# Altium schematic sheet Flash.SchDoc
size A4; SheetNumber: 3; SheetTotal: 4
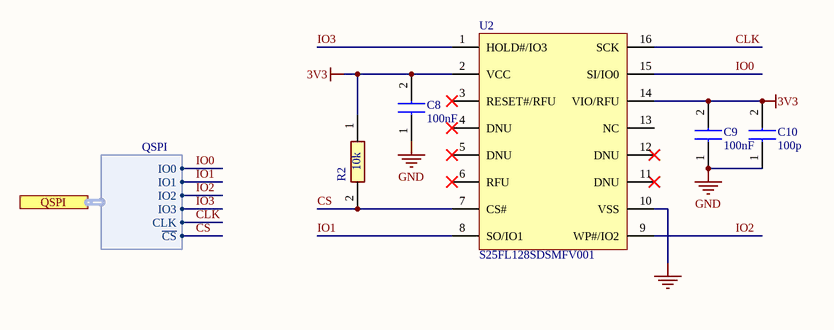
[diagram p0: Flash.SchDoc]

## Parts
C8  100nF  [CAPC1005X70N]
C9  100nF  [CAPC1005X70N]
C10  100p  [CAPC1005X70N]
R2  10k  [RESC1005X35N]
U2  S25FL128SDSMFV001  [ICC_SOIC16_10P30X7P50_P127_H2P65]

## Ports
QSPI (harness QSPI, see main[3D], STM32WB[3B])

## Harnesses
QSPI: IO0, IO1, IO2, IO3, CLK, ~{CS}

## Nets
3V3: C8.2 C9.2 C10.2 R2.1 U2.2(VCC) U2.14(VIO/RFU)
GND: C8.1 C9.1 C10.1 U2.10(VSS)
CLK: U2.16(SCK) ; port QSPI.CLK
CS: R2.2 U2.7(CS#) ; port QSPI.~{CS}
IO0: U2.15(SI/IO0) ; port QSPI.IO0
IO1: U2.8(SO/IO1) ; port QSPI.IO1
IO2: U2.9(WP#/IO2) ; port QSPI.IO2
IO3: U2.1(HOLD#/IO3) ; port QSPI.IO3

Not connected (* = marked no-connect by the designer): U2 3(RESET#/RFU)* 4(DNU)* 5(DNU)* 6(RFU)* 11(DNU)* 12(DNU)* 13(NC)

## Notes on the sheet
- Title:
- Date:
- Project:
- Type:
- Schematic
- Variant:
- Revision:
- Sheet
- of
- Author:
- Evžen Šteif
- Size:
- A4

## Library data of the parts
C8 C9 = GRM155R61A104KA01D: Capacitor; Manufacturer_Name: Murata Electronics; Datasheet Link: https://search.murata.co.jp/Ceramy/image/img/A01X/G101/ENG/GRM155R61A104KA01-02A.pdf; Height: 0.7mm; Manufacturer_Part_Number: GRM155R61A104KA01D; Mouser Part Number: 81-GRM155R61A104KA01; Mouser Price/Stock: https://www.mouser.co.uk/ProductDetail/Murata-Electronics/GRM155R61A104KA01D?qs=5bAuhL3RhmNZw0v59AqOJA%3D%3D; Arrow Part Number: GRM155R61A104KA01D; Arrow Price/Stock: https://www.arrow.com/en/products/grm155r61a104ka01d/murata-manufacturing?utm_currency=USD&region=europe
C10 = GRM1555C1E101JA01D: Capacitor; Manufacturer_Name: Murata Electronics; Datasheet Link: https://search.murata.co.jp/Ceramy/image/img/A01X/G101/ENG/GRM1555C1E101JA01-01A.pdf; Height: 0.7mm; Manufacturer_Part_Number: GRM1555C1E101JA01D; Mouser Part Number: 81-GRM1555C1E101JA1D; Mouser Price/Stock: https://www.mouser.co.uk/ProductDetail/Murata-Electronics/GRM1555C1E101JA01D?qs=wzfj1GSNDILQV4cKnk3IaA%3D%3D; Arrow Part Number: GRM1555C1E101JA01D; Arrow Price/Stock: https://www.arrow.com/en/products/grm1555c1e101ja01d/murata-manufacturing
R2 = RT0402FRE0710KL: Resistor; Manufacturer_Name: KEMET; Datasheet Link: https://cz.mouser.com/datasheet/2/447/PYu_RT_1_to_0_01_RoHS_L_15-3461507.pdf; Height: 0.35mm; Manufacturer_Part_Number: RT0402FRE0710KL; Mouser Part Number: 603-RT0402FRE0710KL; Mouser Price/Stock: https://www.mouser.co.uk/ProductDetail/YAGEO/RT0402FRE07100KL?qs=BXCcY9r%252B08CxTvf5JB1kiw%3D%3D; Arrow Part Number: RT0402FRE07100KL; Arrow Price/Stock: https://www.arrow.com/en/products/rt0402fre07100kl/yageo
U2 = S25FL128SDSMFV001: Quad SPI with SOIC package 16-pins; Internal_Part_Number: MCD-02038; Part_Type: IC; Manufacturer: CYPRESS; Part_Preference: Recommended; Value: S25FL128SDSMFV001; Order_Code_Digikey: S25FL128SDSMFV001-ND; Order_Code_Farnell: N/A; Order_Code_RS: N/A; Status: Released; ComponentLink1URL: http://tunmcdsvn.tun.st.com/Component_Datasheet_Library/Trunk/IC/Cypress_128_Mbit_3V_S25FL128SDSMFV001; Manufacturer_Part_Number: S25FL128SDSMFV001; Alternate_Manufacturer_Part_Number: N/A; Alternate_Manufacturer: N/A; Package: SOIC 16-pins